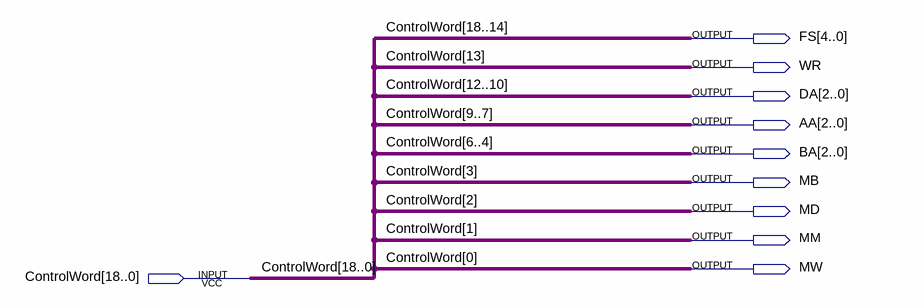
[diagram p0: schematic sheet]
// Quartus schematic ControlVariableSpliter.bdf as structural Verilog: 0 symbols, 10 pins
module ControlVariableSpliter (
  input  [18:0] ControlWord,
  output [4:0] FS,
  output WR,
  output [2:0] DA,
  output [2:0] AA,
  output [2:0] BA,
  output MB,
  output MD,
  output MM,
  output MW
);


  assign AA = ControlWord[9:7];
  assign BA = ControlWord[6:4];
  assign DA = ControlWord[12:10];
  assign FS = ControlWord[18:14];
  assign MB = ControlWord[3];
  assign MD = ControlWord[2];
  assign MM = ControlWord[1];
  assign MW = ControlWord[0];
  assign WR = ControlWord[13];
endmodule
